# Altium schematic sheet lpf.SchDoc: mcHF Pro Transceiver RF board
size A3; Author: Krassi Atanassov; CompanyName: MØNKA; Engineer: For radio amateurs experimentation, non-commercial use only. Thank you!; Revision: 0.8.2; SheetTotal: 14
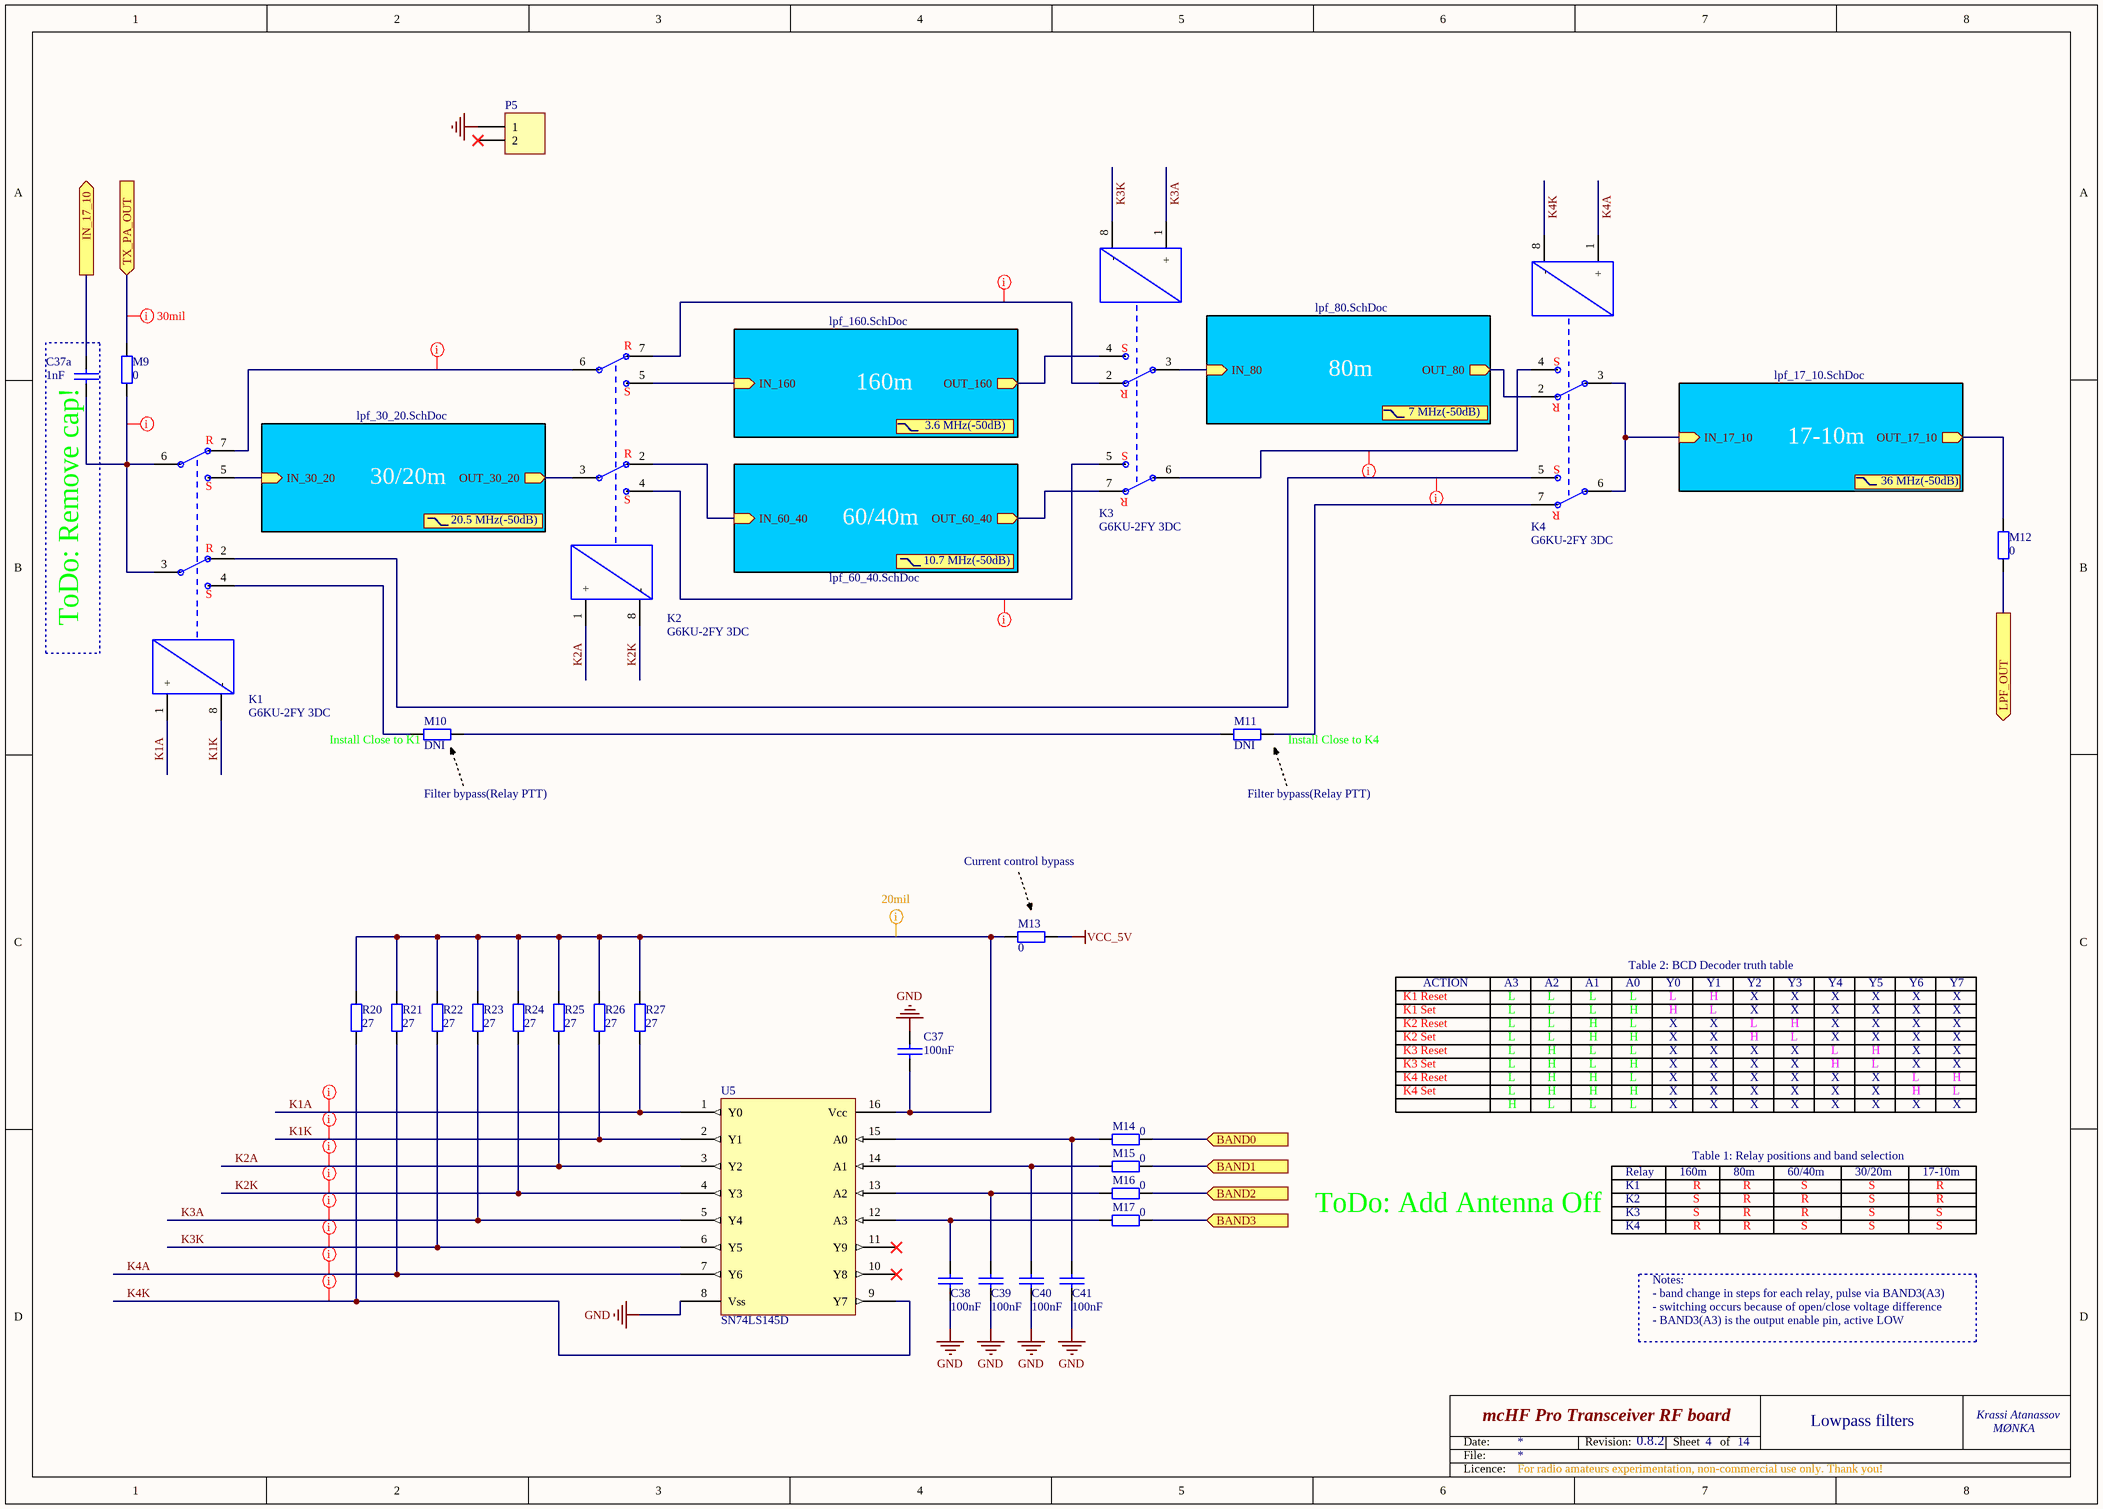
[diagram p0: lpf.SchDoc]

## Parts
C37  100nF  [0805]
C37a  1nF  [0805]
C38  100nF  [0805]
C39  100nF  [0805]
C40  100nF  [0805]
C41  100nF  [0805]
K1  G6KU-2FY 3DC  [Omron_2FY-Pro]
K2  G6KU-2FY 3DC  [Omron_2FY-Pro]
K3  G6KU-2FY 3DC  [Omron_2FY-Pro]
K4  G6KU-2FY 3DC  [Omron_2FY-Pro]
M9  0  [0805]
M10  DNI  [0805]  (no BOM)
M11  DNI  [0805]  (no BOM)
M12  0  [0805]
M13  0  [0805]
M14  0  [0805]
M15  0  [0805]
M16  0  [0805]
M17  0  [0805]
P5  Header 2  [SIP2]  (value not drawn)
R20  27  [1206]
R21  27  [1206]
R22  27  [1206]
R23  27  [1206]
R24  27  [1206]
R25  27  [1206]
R26  27  [1206]
R27  27  [1206]
U5  SN74LS145D  [SO-16]

## Blocks framed on the sheet
ToDo: Remove cap!: C37a

## Sub-sheets
17-10m = lpf_17_10.SchDoc: IN_17_10 (in), OUT_17_10 (out)
30/20m = lpf_30_20.SchDoc: IN_30_20 (in), OUT_30_20 (out)
60/40m = lpf_60_40.SchDoc: IN_60_40 (in), OUT_60_40 (out)
80m = lpf_80.SchDoc: IN_80 (in), OUT_80 (out)
160m = lpf_160.SchDoc: IN_160 (in), OUT_160 (out)

## Ports
BAND0 (in), BAND1 (in), BAND2 (in), BAND3 (in), IN_17_10 (out), LPF_OUT (out), TX_PA_OUT (in)

## Nets
GND: C37.2 C38.1 C39.1 C40.1 C41.1 P5.1 U5.8(Vss)
VCC_5V: M13.2
BAND0: M14.1 ; port BAND0
BAND1: M15.1 ; port BAND1
BAND2: M16.1 ; port BAND2
BAND3: M17.1 ; port BAND3
IN_17_10: C37a.1 ; port IN_17_10
K1A: K1.1(+) R27.1 U5.1(Y0)
K1K: K1.8(-) R26.1 U5.2(Y1)
K2A: K2.1(+) R25.1 U5.3(Y2)
K2K: K2.8(-) R24.1 U5.4(Y3)
K3A: K3.1(+) R23.1 U5.5(Y4)
K3K: K3.8(-) R22.1 U5.6(Y5)
K4A: K4.1(+) R21.1 U5.7(Y6)
K4K: K4.8(-) R20.1 U5.9(Y7)
LPF_OUT: M12.2 ; port LPF_OUT
TX_PA_OUT: M9.2 ; port TX_PA_OUT
NetC37_1: C37.1 M13.1 R20.2 R21.2 R22.2 R23.2 R24.2 R25.2 R26.2 R27.2 U5.16(Vcc)
NetC37a_2: C37a.2 K1.3 K1.6 M9.1
NetC38_2: C38.2 M17.2 U5.12(A3)
NetC39_2: C39.2 M16.2 U5.13(A2)
NetC40_2: C40.2 M15.2 U5.14(A1)
NetC41_2: C41.2 M14.2 U5.15(A0)
NetK1_2: K1.2 K4.5
NetK1_4: K1.4 M10.1
NetK1_5: K1.5 ; sheet 30/20m/IN_30_20
NetK1_7: K1.7 K2.6
NetK2_2: K2.2 ; sheet 60/40m/IN_60_40
NetK2_3: K2.3 ; sheet 30/20m/OUT_30_20
NetK2_4: K2.4 K3.5
NetK2_5: K2.5 ; sheet 160m/IN_160
NetK2_7: K2.7 K3.2
NetK3_3: K3.3 ; sheet 80m/IN_80
NetK3_4: K3.4 ; sheet 160m/OUT_160
NetK3_6: K3.6 K4.4
NetK3_7: K3.7 ; sheet 60/40m/OUT_60_40
NetK4_2: K4.2 ; sheet 80m/OUT_80
NetK4_3: K4.3 K4.6 ; sheet 17-10m/IN_17_10
NetK4_7: K4.7 M11.2
NetM10_2: M10.2 M11.1
NetM12_1: M12.1 ; sheet 17-10m/OUT_17_10

Not connected (* = marked no-connect by the designer): P5 2*; U5 10(Y8)* 11(Y9)*

## Layout directives
rule Width Constraint [Pref Width = 30mil    Min Width = 30mil    Max Width = 30mil]: NetC37a_2, NetK1_2, NetK1_7, NetK2_4, NetK2_7, NetK3_6, TX_PA_OUT
rule Width Constraint [Pref Width = 20mil    Min Width = 20mil    Max Width = 20mil]: K1A, K1K, K2A, K2K, K3A, K3K, K4A, K4K, NetC37_1

## Notes on the sheet
- 3.6 MHz(-50dB)
- 7 MHz(-50dB)
- 36 MHz(-50dB)
- (near K2) 20.5 MHz(-50dB)
- 10.7 MHz(-50dB)
- (near M10) Install Close to K1
- (near M11) Install Close to K4
- Filter bypass(Relay PTT)
- Current control bypass
- ACTION
- A3
- A2
- A1
- A0
- Table 2: BCD Decoder truth table
- Y0
- Y1
- Y2
- Y3
- Y4
- Y5
- Y6
- Y7
- K1 Reset
- K1 Set
- K2 Reset
- K3 Reset
- K2 Set
- L
- H
- X
- K4 Reset
- K3 Set
- K4 Set
- Relay
- K1
- 160m
- Table 1: Relay positions and band selection
- R
- 80m
- 60/40m
- S
- 30/20m
- 17-10m
- ToDo: Add Antenna Off
- K2
- K3
- K4
- - band change in steps for each relay, pulse via BAND3(A3)
- Notes:
- - switching occurs because of open/close voltage difference
- - BAND3(A3) is the output enable pin, active LOW
- 4
- Lowpass filters
- Date:
- File:
- Revision:
- Sheet
- of
- Licence:
- (in symbol G6KU-2FY 3DC) R; S

## Library data of the parts
C37-C41 = CAP: Capacitor; QT Order: QCC-00154; Price: 0.068
C37a = CAP: Capacitor; Voltage: 100V; Price: 0.083
K1-K4 = G6KU-2FY 3DC: Single-winding Latching Relay; Order: FN 118-1070; Price: 2.19
M9-M17 = RES: Resistor; QT Order: QCR-00268; Price: 0.009
P5 = Header 2: Header, 2-Pin
R20-R27 = RES: Resistor; QT Order: QCR-00427; Price: 0.017
U5 = SN74LS145D: BCD DECODER/DRIVER; Price: 1.22